# Altium schematic sheet ESP_Grow_Rev_A.SchDoc
size A
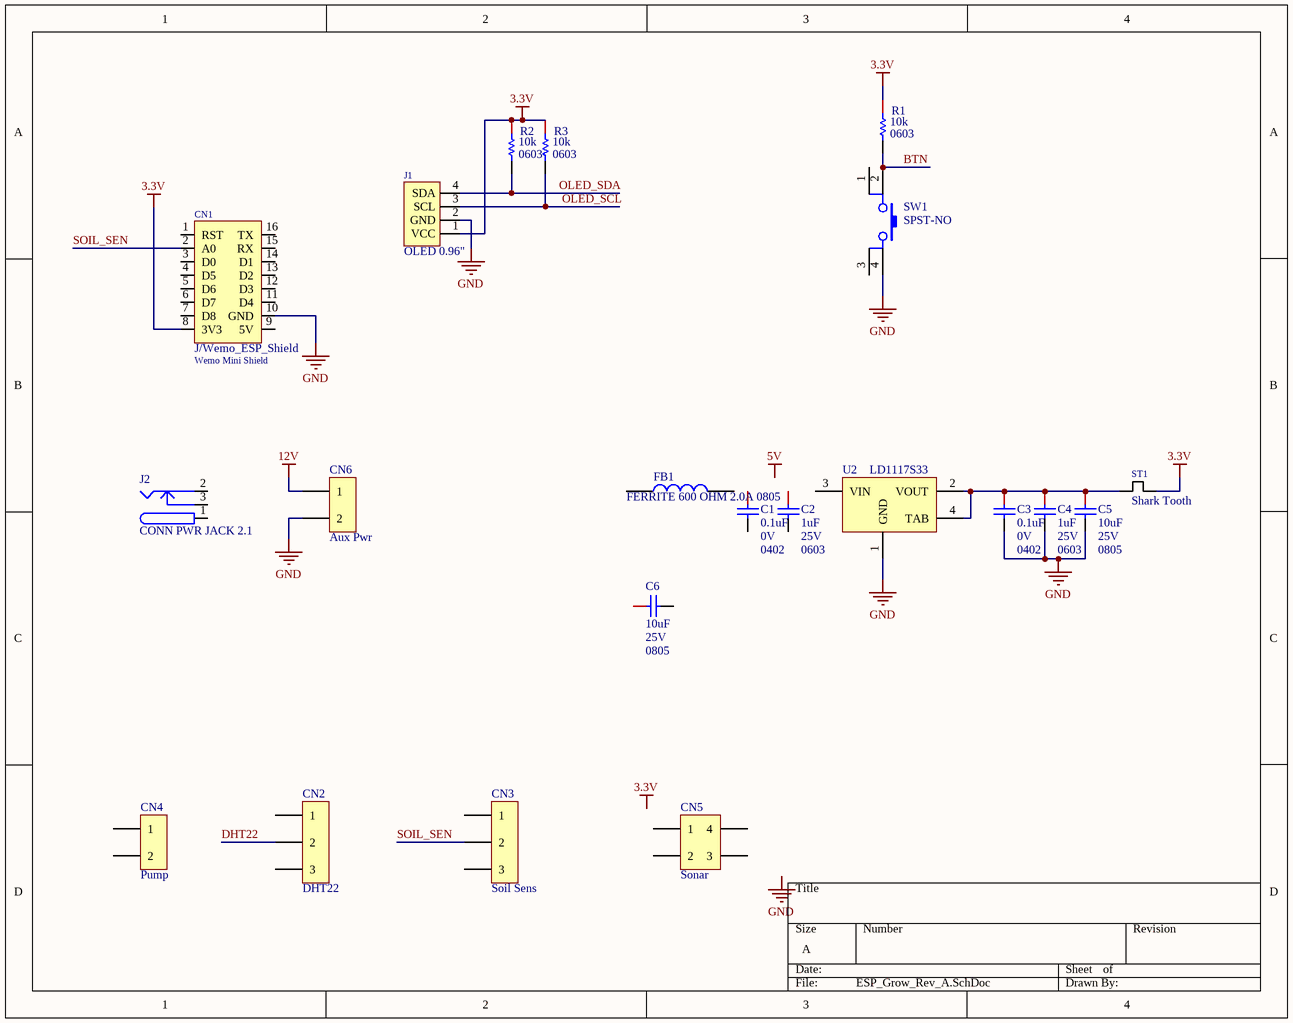
[diagram p0: ESP_Grow_Rev_A.SchDoc]

## Parts
C1  0.1uF  Voltage (Rated): 0V  Package (Imperial): 0402  [CAPC0402(1005)_M]
C2  1uF  Voltage (Rated): 25V  Package (Imperial): 0603  [CAPC0603(1608)_N]
C3  0.1uF  Voltage (Rated): 0V  Package (Imperial): 0402  [CAPC0402(1005)_M]
C4  1uF  Voltage (Rated): 25V  Package (Imperial): 0603  [CAPC0603(1608)_N]
C5  10uF  Voltage (Rated): 25V  Package (Imperial): 0805  [CAPC0805(2012)_L]
C6  10uF  Voltage (Rated): 25V  Package (Imperial): 0805  [CAPC0805(2012)_L]
CN1  J/Wemo_ESP_Shield  Name: Wemo Mini Shield  [Wemos_d1]
CN2  DHT22  [Molex 1x3 Microfit 90deg]
CN3  Soil Sens  [Molex 1x3 Microfit 90deg]
CN4  Pump  [Molex 1x2 Microfit 90deg]
CN5  Sonar  [Molex 2x2 Microfit 90deg]
CN6  Aux Pwr  [Molex 1x2 Microfit 3.0]
FB1  FERRITE 600 OHM 2.0A 0805  [RESC0805(2012)_N]
J1  OLED 0.96"  [OLED_0.96_I2C]
J2  CONN PWR JACK 2.1  [CONN_PWR_JACK_2.1x5.5mm]
R1  Package (Imperial): 0603  [RESC0603(1608)_M]  (hidden comment: 10K)
R2  Package (Imperial): 0603  [RESC0603(1608)_M]  (hidden comment: 10K)
R3  Package (Imperial): 0603  [RESC0603(1608)_M]  (hidden comment: 10K)
ST1  Shark Tooth  [SharkTooth]
SW1  Circuit: SPST-NO  [SW TACT Red 6mm x 6mm]  (hidden comment: PTS645SM43SMTR92 LFS)
U2  LD1117S33  [DSO-G3]

## Nets
3.3V: CN1.8(3V3) J1.1(VCC) R1.1 R2.1 R3.1 ST1.2
12V: CN6.1
GND: C3.2 C4.2 C5.2 CN1.10(GND) CN6.2 J1.2(GND) SW1.4 U2.1(GND)
BTN: R1.2 SW1.2
DHT22: CN2.2
OLED_SCL: J1.3(SCL) R3.2
OLED_SDA: J1.4(SDA) R2.2
SOIL_SEN: CN1.2(A0) CN3.2
NetC3_1: C3.1 C4.1 C5.1 ST1.1 U2.2(VOUT) U2.4(TAB)

Not connected (* = marked no-connect by the designer): C1 1 2; C2 1 2; C6 1 2; CN1 1(RST) 3(D0) 4(D5) 5(D6) 6(D7) 7(D8) 9(5V) 11(D4) 12(D3) 13(D2) 14(D1) 15(RX) 16(TX); CN2 1 3; CN3 1 3; CN4 1 2; CN5 1 2 3 4; FB1 1 2; J2 1 2 3; SW1 1 3; U2 3(VIN)

## Notes on the sheet
- Labels drawn without touching a wire or pin: 3.3V, 5V, GND

## Library data of the parts
C1 C3 = CMP-001-0612-11: CAP CER 0.1UF 50V X7R 0402; Tolerance: 20%; Capacitance: 100nF; Temperature (Max): 125°C; Temperature (Min): -55°C; Package (Metric): 1005; Dielectric Material: Ceramic; Temperature Coefficient: X7R; Length: 1mm; Mounting Type: SMD; Height: 500µm
C2 C4 = CMP-007-0108-08: CAP CER 1UF 25V 10% X7R 0603; Capacitance: 1µF; Temperature (Max): 125°C; Temperature (Min): -55°C; Dielectric Material: Ceramic; Package (Metric): 1608; Length: 1.6mm; Temperature Coefficient: X7R; Tolerance: 10%; Mounting Type: SMD; Width: 800µm; Height: 900µm
C5 C6 = CMP-007-0088-08: CAP CER 10UF 25V X6S 0805; Temperature (Max): 105°C; Temperature (Min): -55°C; Dielectric Material: Ceramic; Capacitance: 10µF; Tolerance: 20%; Package (Metric): 2012; Temperature Coefficient: X6S; Length: 2mm; Mounting Type: SMD; Height: 1.4mm; Width: 1.25mm
CN1 = J/Wemo_ESP_Shield: Wemo Mini Shield for ESP-12
CN2 CN3 = CMP-001-0428-01: Molex Microfit 1x3 90deg Header; Manufacturer: Molex Inc; Manufacturer Part Number: 0436500304; Connector Type: Header, Shrouded; Number of Positions: 3; Number of Positions Loaded: All; Pitch: 0.118" (3.00mm); Component Name: MICROFIT 3.0 HDR 90deg 3CKT; ClassName: *; Supplier 1: Digi-Key; RoHS: RoHS Compliant; Category: Connectors, Interconnects; Stock 1: 42564; Pricing 1: 1=1.39, 10=1.224, 50=1.104, 100=1.056, 250=0.96, 500=0.864, 1000=0.768, 2500=0.696, 5000=0.672 (USD); Packaging: Tray; Contact Type: Male Pin; Number of Rows: 1; Row Spacing: -; Contact Mating Length: -; Mounting Type: Through Hole, Right Angle; Termination: Solder; Fastening Type: Locking Ramp; Features: Board Lock; Contact Finish: Gold; Contact Finish Thickness: 15µin (0.38µm); Color: Black; ComponentLink1URL: http://www.molex.com/pdm_docs/sd/436500304_sd.pdf; ComponentLink1Description: http://www.molex.com/pdm_docs/sd/436500304_sd.pdf; Supplier Part Number 1: WM1876-ND; Pin Count: 3; Designator: MICROFIT 3.0 HDR 90deg 3CKT
CN4 = CMP-001-0425-01: Molex Microfit 1x2 90deg Header; Manufacturer Part Number: 43650-0204; Current Rating: 5 A; Mounting Angle: Right; Number of Positions: 2; Voltage Rating: 600 V; Pitch: 3 mm; Component Name: MICROFIT 3.0 HDR 90deg 2CKT; Supplier 1: Mouser; Manufacturer: Molex; RoHS: RoHS Compliant; Category: Headers & Wire Housings; Stock 1: 3217; Pricing 1: 1=1.55, 10=1.23, 100=1.01, 500=0.961, 1000=0.855, 2000=0.710 (AUD); Contact Plating: Gold; Housing Material: Thermoplastic; Number of Rows: 1; Packaging: Tray; Series: 43650; Termination Style: Through Hole; Type: Shrouded; Brand: Molex; Contact Material: Brass; Mounting Style: -; Product Category: Micro-Fit 3.0 Connectors; Product Type: Headers; Standard Pack Qty: 3927; Tradename: Micro-Fit 3.0; RoHS - Mouser: Y; Minimum Order Quantity: 1; Reeling: False; ComponentLink1URL: http://www.mouser.com/ds/2/276/0436500204_PCB_HEADERS-168465.pdf; ComponentLink1Description: http://www.mouser.com/ds/2/276/0436500204_PCB_HEADERS-168465.pdf; Supplier Part Number 1: 538-43650-0204; ClassName: *; Pin Count: 2; Designator: MICROFIT 3.0 HDR 90deg 2CKT
CN5 = CMP-001-0429-01: Molex Microfit 2x2 90deg Header; Manufacturer: Molex Inc; Manufacturer Part Number: 0430450400; Connector Type: Header, Shrouded; Number of Positions: 4; Number of Positions Loaded: All; Pitch: 0.118" (3.00mm); Component Name: MICROFIT 3.0 HDR 90deg 4CKT; ClassName: *; Supplier 1: Digi-Key; RoHS: RoHS Compliant; Category: Connectors, Interconnects; Stock 1: 9668; Pricing 1: 1=1.35, 10=1.228, 50=1.1026, 100=1.0525, 250=0.95228, 500=0.8771, 1000=0.7518, 2500=0.70168, 5000=0.6666 (USD); Packaging: Tray; Contact Type: Male Pin; Number of Rows: 2; Row Spacing: 0.118" (3.00mm); Contact Mating Length: -; Mounting Type: Through Hole, Right Angle; Termination: Solder; Fastening Type: Locking Ramp; Features: Board Lock; Contact Finish: Tin; Contact Finish Thickness: 100µin (2.54µm); Color: Black; ComponentLink1URL: http://www.molex.com/pdm_docs/sd/430450400_sd.pdf; ComponentLink1Description: http://www.molex.com/pdm_docs/sd/430450400_sd.pdf; Supplier Part Number 1: WM1814-ND; Designator: MICROFIT 3.0 HDR 90deg 4CKT; Pin Count: 4
CN6 = CMP-001-0437-01: Molex Microfit 1x2 Vert Header; Manufacturer Part Number: 0430450227; Manufacturer: Molex, LLC; Number of Positions Loaded: All; Number of Positions: 2; Shrouding: Shrouded - 4 Wall; Features: Board Guide; Pin Count: 2; ComponentLink1URL: http://www.molex.com/pdm_docs/sd/430450227_sd.pdf; Mounting Type: Through Hole; Termination: Solder; Stock 1: 4002; Contact Finish: Tin; Contact Mating Length: -; Packaging: Tray; Designator: MICROFIT 3.0 HDR VERT CPI 2CKT; Component Name: MICROFIT 3.0 HDR VERT CPI 2CKT; ComponentLink1Description: http://www.molex.com/pdm_docs/sd/430450227_sd.pdf; Contact Finish Thickness: 60µin (1.52µm); RoHS: RoHS Compliant; Pitch: -; Pricing 1: 1=0.8, 10=0.705, 50=0.636, 100=0.6083, 250=0.553, 500=0.4977, 1000=0.4424, 2500=0.40092, 5000=0.3871 (USD); Fastening Type: Locking Ramp; Part Status: Active; Number of Rows: 2; Connector Type: Header; Contact Type: Male Pin; Color: Black
FB1 = CMP-007-0197-01: 600 OHM 0805 2.0A; Manufacturer Part Number: 742792040; Manufacturer: Wurth Electronics Inc; Filter Type: Differential Mode - Single; Impedance @ Frequency: 600 Ohm @ 100MHz; DC Resistance (DCR): 150 mOhm Max; Current Rating: 2A; Designator: FERRITE 600 OHM 2.0A 0805; Mounting Type: Surface Mount; Package / Case: 0805 (2012 Metric); Packaging: Cut Tape (CT); Component Name: FERRITE 600 OHM 2.0A 0805; Creator: osman; Stock 1: 34670; ComponentLink1URL: http://katalog.we-online.de/pbs/datasheet/742792040.pdf; RoHS: RoHS Compliant; Pin Count: 2; ComponentLink1Description: http://katalog.we-online.de/pbs/datasheet/742792040.pdf; ClassName: *; Pricing 1: 1=0.24, 50=0.2344, 100=0.2156, 500=0.20624, 1000=0.19687, 2000=0.1875 (USD)
J1 = OLED_0.96_I2C: SSD1306 I2C OLED 0.96"
J2 = CMP-001-0193-01: 2.1 mm barrel jack; Manufacturer Part Number: PJ-002A; Manufacturer: CUI Inc; Plug/Mating Plug Diameter: 2.1mm ID, 5.5mm OD; Number of Positions/Contacts: 2 Conductors, 3 Contacts; Voltage - Rated: 16VDC; Internal Switch(s): Single Switch, Normally Closed; Current Rating: 2.5A; Shielding: Unshielded; Gender: Male; Features: -; RoHS: RoHS Compliant; Connector Type: Jack; Color: Black; ComponentLink2Description: http://www.cui.com/product/resource/digikeypdf/pj-002a.pdf; ComponentLink3URL: http://www.cui.com/product/resource/digikeypdf/pj-002ah.pdf; Pin Count: 3; Published: 17-Dec-2003; ComponentLink3Description: http://www.cui.com/product/resource/digikeypdf/pj-002ah.pdf; Housing Material: Thermoplastic; Termination: Solder Eyelet(s); Designator: CONN PWR JACK 2.1; Contact Material - Plating: Tin; Component Name: CONN PWR JACK 2.1; Stock 1: 47553; Publisher: Altium Limited; Housing Color: Black; Contact Material: Copper Alloy; Mounting Type: Through Hole, Right Angle; ComponentLink1Description: Manufacturer Link; ComponentLink1URL: http://domino.kycon.com/internet/Products.html; ComponentLink2URL: http://www.cui.com/product/resource/digikeypdf/pj-002a.pdf; Operating Temperature: -25°C ~ 85°C; Pricing 1: 1=1.01, 10=0.704, 100=0.4724, 500=0.3819, 1000=0.3417, 2500=0.27135 (USD); DatasheetDocument: 09-May-2002
R1-R3 = CMP-007-0359-12: RES 10K OHM 1/10W 1% 0603 SMD; Package (Metric): 1608; Power: 100mW; Temperature Coefficient: ±100ppm/°C; Height: 550µm; Resistance: 10k; Termination: SMD/SMT; Tolerance: 1%
ST1 = Shark Tooth: Sharks Tooth Small
SW1 = CMP-011-0021-01: SWITCH TACTILE SPST-NO 0.05A 12V; Manufacturer: C&K; Actuator Type: Standard; Mechanical Life: 100,000 Cycles; Operating Force: 160gf; Outline: 6.00mm x 6.00mm; Illumination: Non-Illuminated; Actuator Material: Polyamide (PA66), Nylon 6/6; Actuator Orientation: Top Actuated; Contact Rating @ Voltage: 0.05A @ 12VDC; Actuator Height off PCB, Vertical: 4.30mm; Switch Function: Off-Mom; Illumination Type, Color: -; ClassName: *; Switch Travel: -; ComponentLink1URL: http://www.ckswitches.com/media/1471/pts645.pdf; ComponentLink1Description: http://www.ckswitches.com/media/1471/pts645.pdf; Part Status: Active; Packaging: Cut Tape (CT); Pricing 1: 1=0.15, 10=0.147, 25=0.1416, 50=0.1366, 100=0.129, 250=0.12144, 500=0.11638 (USD); RoHS: RoHS Compliant; Actuator Length, Right Angle: -; Features: Blue Actuator; Stock 1: 234699; Component Name: PTS645SM43SMTR92 LFS; Ingress Protection: -; Termination Style: Gull Wing; Designator: PTS645SM43SMTR92 LFS; Illumination Voltage (Nominal): -; Operating Temperature: -20°C ~ 60°C; Manufacturer Part Number: PTS645SM43SMTR92 LFS; Mounting Type: Surface Mount; Pin Count: 4
U2 = CMP-008-0010-01: 3.3 volt fixed regulator, 800mA; Pin Count: 4; Designator: LD1117S33; Component Name: LD1117S33